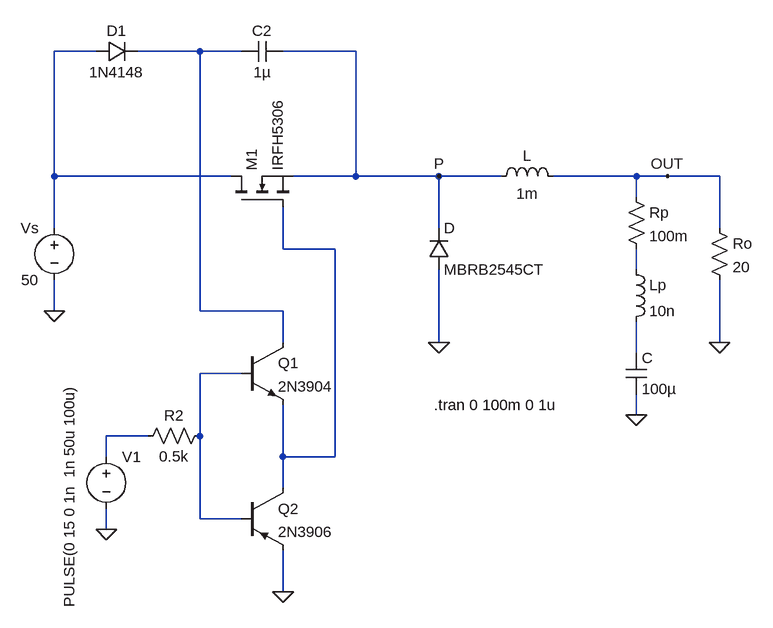
[diagram p0: schematic buck_converter_high_side_driver.asc]
buck_converter_high_side_driver.asc, the LTspice schematic file:
Version 4.1
SHEET 1 1028 932
WIRE -224 -64 -288 -64
WIRE -64 -64 -160 -64
WIRE 0 -64 -64 -64
WIRE 176 -64 64 -64
WIRE -288 128 -288 -64
WIRE -16 128 -288 128
WIRE 176 128 176 -64
WIRE 176 128 80 128
WIRE 304 128 176 128
WIRE 400 128 304 128
WIRE 608 128 480 128
WIRE 656 128 608 128
WIRE 736 128 656 128
WIRE 608 160 608 128
WIRE -288 208 -288 128
WIRE 304 208 304 128
WIRE 736 208 736 128
WIRE 64 240 64 176
WIRE 144 240 64 240
WIRE 608 272 608 240
WIRE -288 336 -288 288
WIRE -64 336 -64 -64
WIRE 64 336 -64 336
WIRE 64 384 64 336
WIRE 304 384 304 272
WIRE 736 384 736 288
WIRE 608 400 608 352
WIRE 0 432 -64 432
WIRE 608 496 608 464
WIRE -144 528 -208 528
WIRE -64 528 -64 432
WIRE -208 560 -208 528
WIRE 64 560 64 480
WIRE 144 560 144 240
WIRE 144 560 64 560
WIRE 64 608 64 560
WIRE -64 656 -64 528
WIRE 0 656 -64 656
WIRE -208 672 -208 640
WIRE 64 768 64 704
FLAG 656 128 OUT
FLAG 304 128 P
FLAG 304 384 0
FLAG 736 384 0
FLAG 608 496 0
FLAG 64 768 0
FLAG -208 672 0
FLAG -288 336 0
SYMBOL voltage -288 192 M0
WINDOW 123 0 0 Left 0
WINDOW 39 0 0 Left 0
SYMATTR InstName Vs
SYMATTR Value 50
SYMBOL nmos -16 176 R270
SYMATTR InstName M1
SYMATTR Value IRFH5306
SYMBOL diode 288 272 M180
WINDOW 0 24 64 Left 2
WINDOW 3 24 0 Left 2
SYMATTR InstName D
SYMATTR Value MBRB2545CT
SYMBOL ind 384 144 R270
WINDOW 0 32 56 VTop 2
WINDOW 3 5 56 VBottom 2
SYMATTR InstName L
SYMATTR Value 1m
SYMBOL cap 592 400 R0
SYMATTR InstName C
SYMATTR Value 100µ
SYMBOL res 720 192 R0
SYMATTR InstName Ro
SYMATTR Value 20
SYMBOL res 592 144 R0
SYMATTR InstName Rp
SYMATTR Value 100m
SYMBOL ind 592 256 R0
SYMATTR InstName Lp
SYMATTR Value 10n
SYMBOL npn 0 384 R0
SYMATTR InstName Q1
SYMATTR Value 2N3904
SYMBOL res -48 512 R90
WINDOW 0 0 56 VBottom 2
WINDOW 3 32 56 VTop 2
SYMATTR InstName R2
SYMATTR Value 0.5k
SYMBOL voltage -208 544 R0
WINDOW 3 -57 248 VLeft 2
WINDOW 123 0 0 Left 0
WINDOW 39 0 0 Left 0
SYMATTR InstName V1
SYMATTR Value PULSE(0 15 0 1n  1n 50u 100u)
SYMBOL pnp 0 608 R0
SYMATTR InstName Q2
SYMATTR Value 2N3906
SYMBOL cap 64 -80 R90
WINDOW 0 0 32 VBottom 2
WINDOW 3 32 32 VTop 2
SYMATTR InstName C2
SYMATTR Value 1µ
SYMBOL diode -224 -48 R270
WINDOW 0 32 32 VTop 2
WINDOW 3 0 32 VBottom 2
SYMATTR InstName D1
SYMATTR Value 1N4148
TEXT 296 480 Left 2 !.tran 0 100m 0 1u

The netlist it stands for:
* buck_converter_high_side_driver.asc
Vs N001 0 50
M1 N001 N003 P P IRFH5306
D 0 P MBRB2545CT
L P OUT 1m
C N005 0 100µ
Ro OUT 0 20
Rp OUT N004 100m
Lp N004 N005 10n
Q1 N002 N006 N003 0 2N3904
R2 N006 N007 0.5k
V1 N007 0 PULSE(0 15 0 1n  1n 50u 100u)
Q2 N003 N006 0 0 2N3906
C2 P N002 1µ
D1 N001 N002 1N4148
.model D D
.lib standard.dio
.model NPN NPN
.model PNP PNP
.lib standard.bjt
.model NMOS NMOS
.model PMOS PMOS
.lib standard.mos
.tran 0 100m 0 1u
.backanno
.end